# Altium schematic sheet Sheet1.SchDoc
size 381 x 241 mm; SheetNumber: 1; SheetTotal: 1
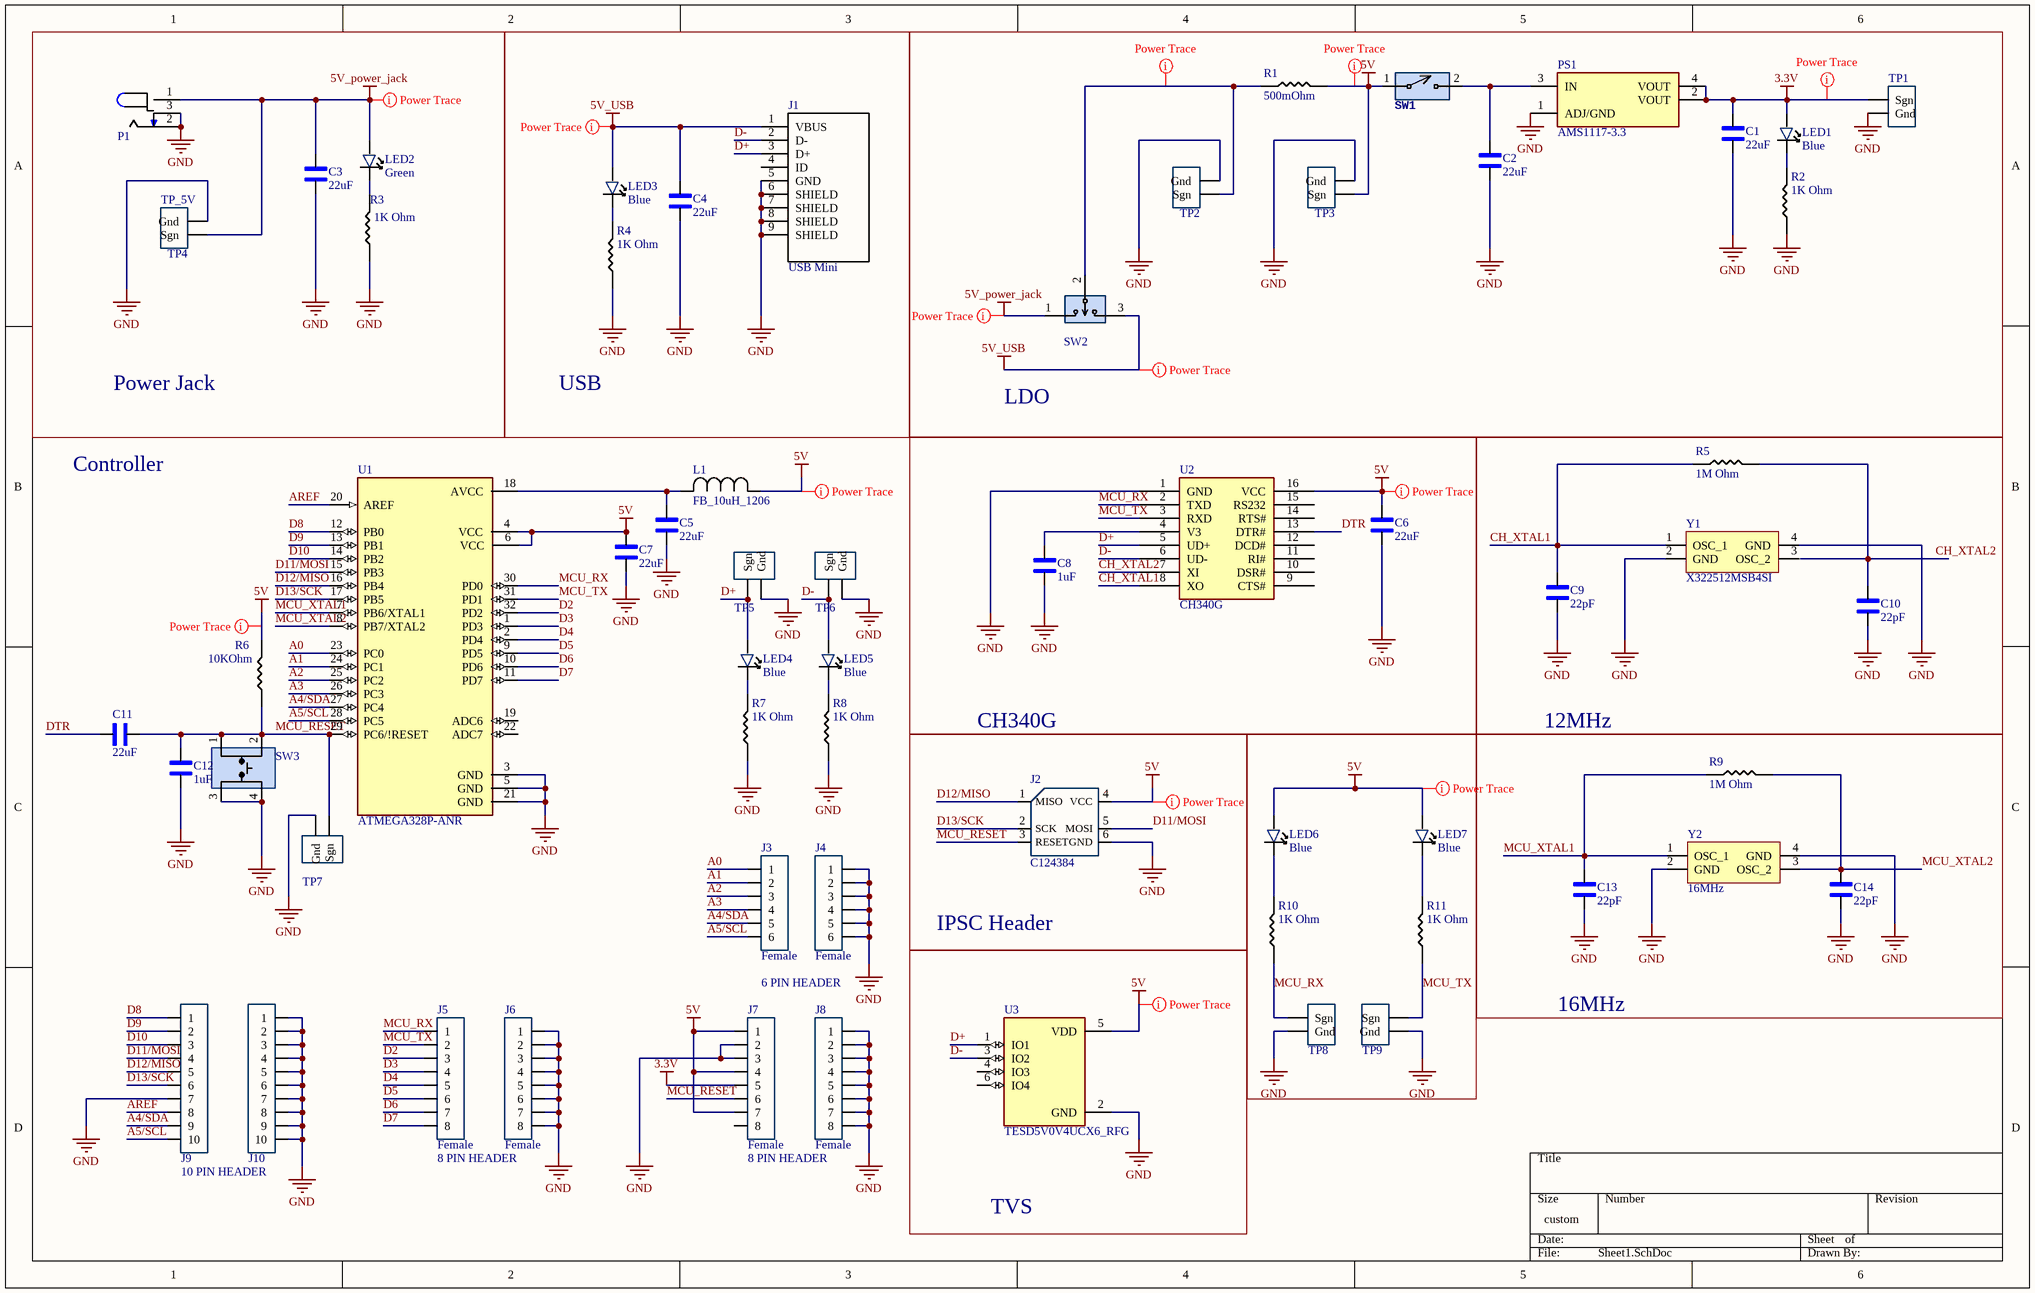
[diagram p0: Sheet1.SchDoc]

## Parts
C1  22uF  [1206_Passive_Capacitor]
C2  22uF  [1206_Passive_Capacitor]
C3  22uF  [1206_Passive_Capacitor]
C4  22uF  [1206_Passive_Capacitor]
C5  22uF  [1206_Passive_Capacitor]
C6  22uF  [1206_Passive_Capacitor]
C7  22uF  [1206_Passive_Capacitor]
C8  1uF  [1206_Passive_Capacitor]
C9  22pF  [1206_Passive_Capacitor]
C10  22pF  [1206_Passive_Capacitor]
C11  22uF  [1206_Passive_Capacitor]
C12  1uF  [1206_Passive_Capacitor]
C13  22pF  [1206_Passive_Capacitor]
C14  22pF  [1206_Passive_Capacitor]
J1  USB Mini  [USB_MINI_B]
J2  LCSC Part#: C124384  [ICSP]  (hidden comment: NRPN032PAEN-RC)
J3  value Female  [6_PIN_100MIL -Female]
J4  value Female  [6_PIN_100MIL -Female]
J5  value Female  [8_PIN_100MIL - Female]
J6  value Female  [8_PIN_100MIL - Female]
J7  value Female  [8_PIN_100MIL - Female]
J8  value Female  [8_PIN_100MIL - Female]
J9  PPTC101LFBN-RC  [10_PIN_100MIL - Female]  (value not drawn)
J10  PPTC101LFBN-RC  [10_PIN_100MIL - Female]  (value not drawn)
L1  FB_10uH_1206  [AIML-1206_ABR-M]
LED1  Blue  [LED_1206]
LED2  Green  [LED_1206]
LED3  Blue  [LED_1206]
LED4  Blue  [LED_1206]
LED5  Blue  [LED_1206]
LED6  Blue  [LED_1206]
LED7  Blue  [LED_1206]
P1  Power Jack  [Power_Jack]  (value not drawn)
PS1  AMS1117-3.3  [LDO]
R1  value 500mOhm  [1206_Passive_Resitor]  (hidden comment: 500m)
R2  value 1K Ohm  [1206_Passive_Resitor]  (hidden comment: 1k)
R3  value 1K Ohm  [1206_Passive_Resitor]  (hidden comment: 1k)
R4  value 1K Ohm  [1206_Passive_Resitor]  (hidden comment: 1k)
R5  value 1M Ohm  [1206_Passive_Resitor]  (hidden comment: 1M)
R6  value 10KOhm  [1206_Passive_Resitor]  (hidden comment: 10k)
R7  value 1K Ohm  [1206_Passive_Resitor]  (hidden comment: 1k)
R8  value 1K Ohm  [1206_Passive_Resitor]  (hidden comment: 1k)
R9  value 1M Ohm  [1206_Passive_Resitor]  (hidden comment: 1M)
R10  value 1K Ohm  [1206_Passive_Resitor]  (hidden comment: 1k)
R11  value 1K Ohm  [1206_Passive_Resitor]  (hidden comment: 1k)
SW1  SW_2Pin_100mil_Switch  [2Pin-Header-Conn]  (value not drawn)
SW2  PREC003SAAN-RC  [3_PIN_100mil]  (value not drawn)
SW3  TL3305AF160QG  [Switch_JLC]  (value not drawn)
TP1  (no value)  [TP10x_Probe]
TP2  (no value)  [TP10x_Probe]
TP3  (no value)  [TP10x_Probe]
TP4  TP_5V  [TP10x_Probe]
TP5  10x Probe TP  [TP10x_Probe]  (value not drawn)
TP6  10x Probe TP  [TP10x_Probe]  (value not drawn)
TP7  10x Probe TP  [TP10x_Probe]  (value not drawn)
TP8  10x Probe TP  [TP10x_Probe]  (value not drawn)
TP9  10x Probe TP  [TP10x_Probe]  (value not drawn)
U1  ATMEGA328P-ANR  [ATMega328P]
U2  CH340G  [USB to serial]
U3  TESD5V0V4UCX6_RFG  [SOT95P280X145-6N]
Y1  X322512MSB4SI  [Crystal resonator]
Y2  value 16MHz  [Crystal resonator]  (hidden comment: X322516MLB4SI)

## Blocks framed on the sheet
Power Jack: C3 LED2 P1 R3 TP4
USB: C4 J1 LED3 R4
LDO: C1 C2 LED1 PS1 R1 R2 SW1 SW2 TP1-TP3
CH340G: C6 C8 U2
12MHz: C9 C10 R5 Y1

## Nets
3.3V: C1.2 J7.5 LED1.1 PS1.2(VOUT) PS1.4(VOUT) TP1.1(Sgn)
5V: C6.2 C7.2 J2.4(VCC) J7.1 J7.4 J7.7 L1.1 LED6.1 LED7.1 R1.2 R6.2 SW1.1 TP3.1(Sgn) U1.4(VCC) U1.6(VCC) U2.16(VCC) U3.5(VDD)
5V_power_jack: C3.2 LED2.1 P1.1 SW2.1 TP4.1(Sgn)
5V_USB: C4.2 J1.1(VBUS) LED3.1 SW2.3
GND: C1.1 C2.1 C3.1 C4.1 C5.1 C6.1 C7.1 C8.1 C9.1 C10.1 C12.1 C13.1 C14.1 J1.5(GND) J1.6(SHIELD) J1.7(SHIELD) J1.8(SHIELD) J1.9(SHIELD) J2.6(GND) J4.1 J4.2 J4.3 J4.4 J4.5 J4.6 J6.1 J6.2 J6.3 J6.4 J6.5 J6.6 J6.7 J6.8 J7.2 J7.3 J8.1 J8.2 J8.3 J8.4 J8.5 J8.6 J8.7 J8.8 J9.7 J10.1 J10.2 J10.3 J10.4 J10.5 J10.6 J10.7 J10.8 J10.9 J10.10 P1.2 P1.3 PS1.1(ADJ/GND) R2.1 R3.1 R4.1 R7.1 R8.1 SW3.3 SW3.4 TP1.2(Gnd) TP2.2(Gnd) TP3.2(Gnd) TP4.2(Gnd) TP5.2(Gnd) TP6.2(Gnd) TP7.2(Gnd) TP8.2(Gnd) TP9.2(Gnd) U1.3(GND) U1.5(GND) U1.21(GND) U2.1(GND) U3.2(GND) Y1.2(GND) Y1.4(GND) Y2.2(GND) Y2.4(GND)
A0: J3.1 U1.23(PC0)
A1: J3.2 U1.24(PC1)
A2: J3.3 U1.25(PC2)
A3: J3.4 U1.26(PC3)
A4/SDA: J3.5 J9.9 U1.27(PC4)
A5/SCL: J3.6 J9.10 U1.28(PC5)
AREF: J9.8 U1.20(AREF)
CH_XTAL1: C9.2 R5.1 U2.8(XO) Y1.1(OSC_1)
CH_XTAL2: C10.2 R5.2 U2.7(XI)
D2: J5.3 U1.32(PD2)
D3: J5.4 U1.1(PD3)
D4: J5.5 U1.2(PD4)
D5: J5.6 U1.9(PD5)
D6: J5.7 U1.10(PD6)
D7: J5.8 U1.11(PD7)
D8: J9.1 U1.12(PB0)
D9: J9.2 U1.13(PB1)
D10: J9.3 U1.14(PB2)
D11/MOSI: J2.5(MOSI) J9.4 U1.15(PB3)
D12/MISO: J2.1(MISO) J9.5 U1.16(PB4)
D13/SCK: J2.2(SCK) J9.6 U1.17(PB5)
D+: J1.3(D+) LED4.1 TP5.1(Sgn) U2.5(UD+) U3.1(IO1)
D-: J1.2(D-) LED5.1 TP6.1(Sgn) U2.6(UD-) U3.3(IO2)
DTR: C11.1 U2.13(DTR#)
MCU_RESET: C11.2 C12.2 J2.3(RESET) J7.6 R6.1 SW3.1 SW3.2 TP7.1(Sgn) U1.29(PC6/!RESET)
MCU_RX: J5.1 R10.1 TP8.1(Sgn) U1.30(PD0) U2.2(TXD)
MCU_TX: J5.2 R11.1 TP9.1(Sgn) U1.31(PD1) U2.3(RXD)
MCU_XTAL1: C13.2 R9.1 U1.7(PB6/XTAL1) Y2.1(OSC_1)
MCU_XTAL2: C14.2 R9.2 U1.8(PB7/XTAL2) Y2.3(OSC_2)
NetC2_2: C2.2 PS1.3(IN) SW1.2
NetC5_2: C5.2 L1.2 U1.18(AVCC)
NetC8_2: C8.2 U2.4(V3)
NetLED1_2: LED1.2 R2.2
NetLED2_2: LED2.2 R3.2
NetLED3_2: LED3.2 R4.2
NetLED4_2: LED4.2 R7.2
NetLED5_2: LED5.2 R8.2
NetLED6_2: LED6.2 R10.2
NetLED7_2: LED7.2 R11.2
NetR1_1: R1.1 SW2.2 TP2.1(Sgn)

Not connected (* = marked no-connect by the designer): J1 4(ID); J7 8; U1 19(ADC6) 22(ADC7); U2 9(CTS#) 10(DSR#) 11(RI#) 12(DCD#) 14(RTS#) 15(RS232); U3 4(IO3) 6(IO4); Y1 3(OSC_2)

## Layout directives
rule Width Constraint [Pref Width = 20mil    Min Width = 10mil    Max Width = 100mil]: 3.3V, 5V, 5V_power_jack, 5V_USB, NetR1_1

## Notes on the sheet
- Controller
- IPSC Header
- 6 PIN HEADER
- 16MHz
- 10 PIN HEADER
- 8 PIN HEADER
- TVS

## Library data of the parts
C1-C7 C11 = C_22uF_1206: 22uF ±10% 25V X5R 1206 Multilayer Ceramic Capacitors MLCC - SMD/SMT RoHS; MFR Part #: CL31A226KAHNNNE; Type: basic; LCSC Part#: C12891; Datasheet: https://datasheet.lcsc.com/lcsc/1811031514_Samsung-Electro-Mechanics-CL31A226KAHNNNE_C12891.pdf; Value: 22uF
C8 C12 = C_1uF_1206: MULTILAYER CERAMIC CAPACITORS MLCC - SMD/SMT 1UF 50V 1206 ROHS; MFR Part #: CL31B105KBHNNNE; Type: Basic; Digikey Link: https://www.digikey.com/product-detail/en/C1206C105M4RACTU/399-8150-1-ND/3471873/?itemSeq=304982366; LCSC Part#: C1848; Value: 1uF
C9 C10 C13 C14 = C_22pF_1206: 22pF ±5% 1kV C0G 1206 Multilayer Ceramic Capacitors MLCC - SMD/SMT RoHS; MFR Part #: CC1206JKNPOCBN220; Type: Extended; LCSC Part#: C107174; Datasheet: https://datasheet.lcsc.com/lcsc/1810241219_YAGEO-CC1206JKNPOCBN220_C107174.pdf; Value: 22pF
J1 = J_USB_B_Mini: Through Hole USB Connectors RoHS; MFR Part #: 920-462A2021D10102; Value: USB mini B; LCSC Part#: C46398; Datasheet: https://datasheet.lcsc.com/szlcsc/2103081233_Jing-Extension-of-the-Electronic-Co-920-462A2021D10102_C46398.pdf; Type: Extended
J2 = J_ICSP: Connector Header Through Hole 6 position 0.079" (2.00mm); Digikey Link: https://www.digikey.com/product-detail/en/NRPN032PAEN-RC/S5801-03-ND/804955/?itemSeq=304982355; MFR Part #: NRPN032PAEN-RC; Type: Extended
J3 J4 = JF_6_PIN_FEMALE: 6 Position Header Connector 0.100" (2.54mm) Through Hole Tin; MFR Part #: PPTC061LFBN-RC; Digikey Link: https://www.digikey.com/product-detail/en/PPTC061LFBN-RC/S7004-ND/810145/?itemSeq=304982353; LCSC Part#: C40877; Type: Extended
J5-J8 = JF_8_PIN_FEMALE: 8 Position Header Connector 0.100" (2.54mm) Through Hole Tin; MFR Part #: PPTC081LFBN-RC; Digikey Link: https://www.digikey.com/product-detail/en/PPTC081LFBN-RC/S7006-ND/810147/?itemSeq=304982354; Type: Extended; LCSC Part#: C27438
J9 J10 = JF_10_PIN_FEMALE_: 10 Position Header Connector 0.100" (2.54mm) Through Hole Tin; Value: Female; Digikey Link: https://www.digikey.com/product-detail/en/PPTC101LFBN-RC/S7008-ND/810149/?itemSeq=304982352; MFR Part #: PPTC101LFBN-RC; LCSC Part#: C225507; Type: Extended
L1 = FB_10uH_1206: 25mA 10uH ±10% 800mΩ 1206  Inductors (SMD) ROHS; Mfr_Name: FH (Guangdong Fenghua Advanced Tech); MFR PART #: CMI321609X100KT; Type: Basic; LCSC PART#: C1051; DataSheet: https://datasheet.lcsc.com/lcsc/1810311314_FH--Guangdong-Fenghua-Advanced-Tech-CMI321609X100KT_C1051.pdf
LED1 LED3-LED7 = LED_BLUE_1206: blue 1206  Light Emitting Diodes (LED) ROHS; MFR Part #: NCD1206B1; Type: Extended; LCSC Part#: C130717; Datasheet: https://datasheet.lcsc.com/lcsc/2008201033_Foshan-NationStar-Optoelectronics-NCD1206B1_C130717.pdf; Value: Blue
LED2 = LED_GREEN_1206: Green 513~528nm 1206 Light Emitting Diodes (LED) RoHS; MFR Part #: SZYY1206G; Type: Extended; LCSC Part#: C434439; Datasheet: https://datasheet.lcsc.com/lcsc/2006301532_Yongyu-Photoelectric-SZYY1206G_C434439.pdf; Value: Green
P1 = P_Power Jack: Power Barrel Connector Jack 2.10mm ID (0.083"), 5.50mm OD (0.217") Through Hole, Right Angle; MFR Part #: PJ-102A; Value: CONN PWR JACK 2X5.5MM SOLDER; Digikey Link: https://www.digikey.com/product-detail/en/PJ-102A/CP-102A-ND/275425/?itemSeq=304982367; LCSC Part#: C136744; Type: Extended
PS1 = PS_AMS_LDO_3v3: LOW DROPOUT REGULATORS(LDO) POSITIVE FIXED 1.3V @ 800MA 15V 3.3V 1A SOT-223 ROHS; Value: IC REG LINEAR 3.3V 800MA SOT223; MFR Part #: AMS1117-3.3; LCSC Part#: C6186; Type: Basic
R1 = R_500mOhm_1206: Resistors/Shunt 250mW 500mΩ ±800ppm/℃ ±5% 1206  Current Sense  Resistors ROHS; MFR Part #: 1206W4J050KT5E; Datasheet: https://datasheet.lcsc.com/lcsc/1810301438_UNI-ROYAL-Uniroyal-Elec-1206W4J050KT5E_C247433.pdf; LCSC Part#: C247433; Type: Extended
R2-R4 R7 R8 R10 R11 = R_1K_1206: CHIP RESISTOR - SURFACE MOUNT 1KOHMS ±1% 1/4W 1206 ROHS; MFR Part #: RNCP1206FTD1K00CT; Digikey Link: https://www.digikey.com/product-detail/en/RNCP1206FTD1K00/RNCP1206FTD1K00CT-ND/2240675/?itemSeq=304982373; LCSC Part#: C4410; Type: Basic
R5 R9 = R_1M_1206: CHIP RESISTOR - SURFACE MOUNT 1MOHMS ±1% 1/4W 1206 ROHS; MFR Part #: RMCF1206JT1M00; Digikey Link: https://www.digikey.com/product-detail/en/RMCF1206JT1M00/RMCF1206JT1M00CT-ND/1942830/?itemSeq=304982358; LCSC Part#: C17927; Type: Basic
R6 = R_10KOhm_1206: 10 kOhms ±5% 0.25W, 1/4W Chip Resistor 1206 (3216 Metric) Automotive AEC-Q200 Thick Film; MFR Part #: RMCF1206FT10K0; Digikey Link: https://www.digikey.com/en/products/detail/stackpole-electronics-inc/RMCF1206FT10K0/1759669; LCSC Part#: C17902; Type: Basic
SW1 = SW_2Pin_100mil_Switch: 2Pin Header; LCSC Part#: C124375; Type: Extended
SW2 = SW_3Pin_100mil_Switch: Connector Header Through Hole 3 position 0.100" (2.54mm); Value: CONN HEADER VERT 3POS 2.54MM; Digikey Link: https://www.digikey.com/product-detail/en/PREC003SAAN-RC/S1012EC-03-ND/2774851/?itemSeq=304982371; MFR Part #: PREC003SAAN-RC; Type: Extended; LCSC Part#: C49257
SW3 = SW_Push_Button_JLC: Tactile Switch SPST-NO Top Actuated Surface Mount; MFR Part #: KH-4.5X4.5X4.3H-STM; LCSC Part#: C2837550; Type: Extended; DataSheet: https://datasheet.lcsc.com/lcsc/2106081532_Shenzhen-Kinghelm-Elec-KH-4.5X4.5X4.3H-STM_C2837550.pdf
TP1-TP9 = TP_10x_Probe: Test Point 300 mil centers
U1 = U_ATMega328P: AVR AVR® ATmega Microcontroller IC 8-Bit 20MHz 32KB (16K x 16) FLASH 32-TQFP (7x7); MFR Part #: ATMEGA328P-AU; Value: IC MCU 8BIT 32KB FLASH 32TQFP; Digikey Link: https://www.digikey.com/product-detail/en/ATMEGA328P-ANR/ATMEGA328P-ANRCT-ND/2774230/?itemSeq=304982365; LCSC Part#: C14877; Type: Basic
U2 = U_USBtoSerial: Transceiver USB 2.0 2Mbps SOP-16_150mil USB ICs RoHS; Datasheet: https://datasheet.lcsc.com/lcsc/2008191806_WCH-Jiangsu-Qin-Heng-CH340G_C14267.pdf; LCSC Part#: C14267; MFR Part #: CH340G; Type: Basic; Value: USB to Serial
U3 = TESD5V0V4UCX6_RFG: SOT-26, 5V, 75W, 0.6pF, ESD Protection; MF: Taiwan Semiconductor; MP: TESD5V0V4UCX6 RFG; SnapEDA_Link: https://www.snapeda.com/parts/TESD5V0V4UCX6%20RFG/Taiwan+Semiconductor/view-part/?ref=snap; Package: None; Value: *; Check_prices: https://www.snapeda.com/parts/TESD5V0V4UCX6%20RFG/Taiwan+Semiconductor/view-part/?ref=eda
Y1 = X_12MHz_Res: SMD Crystal Resonators 12MHz ±10ppm SMD-3225_4P RoHS; LCSC Part#: C9002; MFR Part #: X322512MSB4SI; Value: 12MHz; Type: Basic; Datasheet: https://datasheet.lcsc.com/szlcsc/Yangxing-Tech-X322512MSB4SI_C9002.pdf
Y2 = X_16Mhz_Res: ±10ppm 16000000Hz -40℃~85℃ 贴片无源晶振 60Ω 9pF SMD3225-4P Crystals ROHS; LCSC Part#: C13738; MFR Part #: X322516MLB4SI; Type: Basic